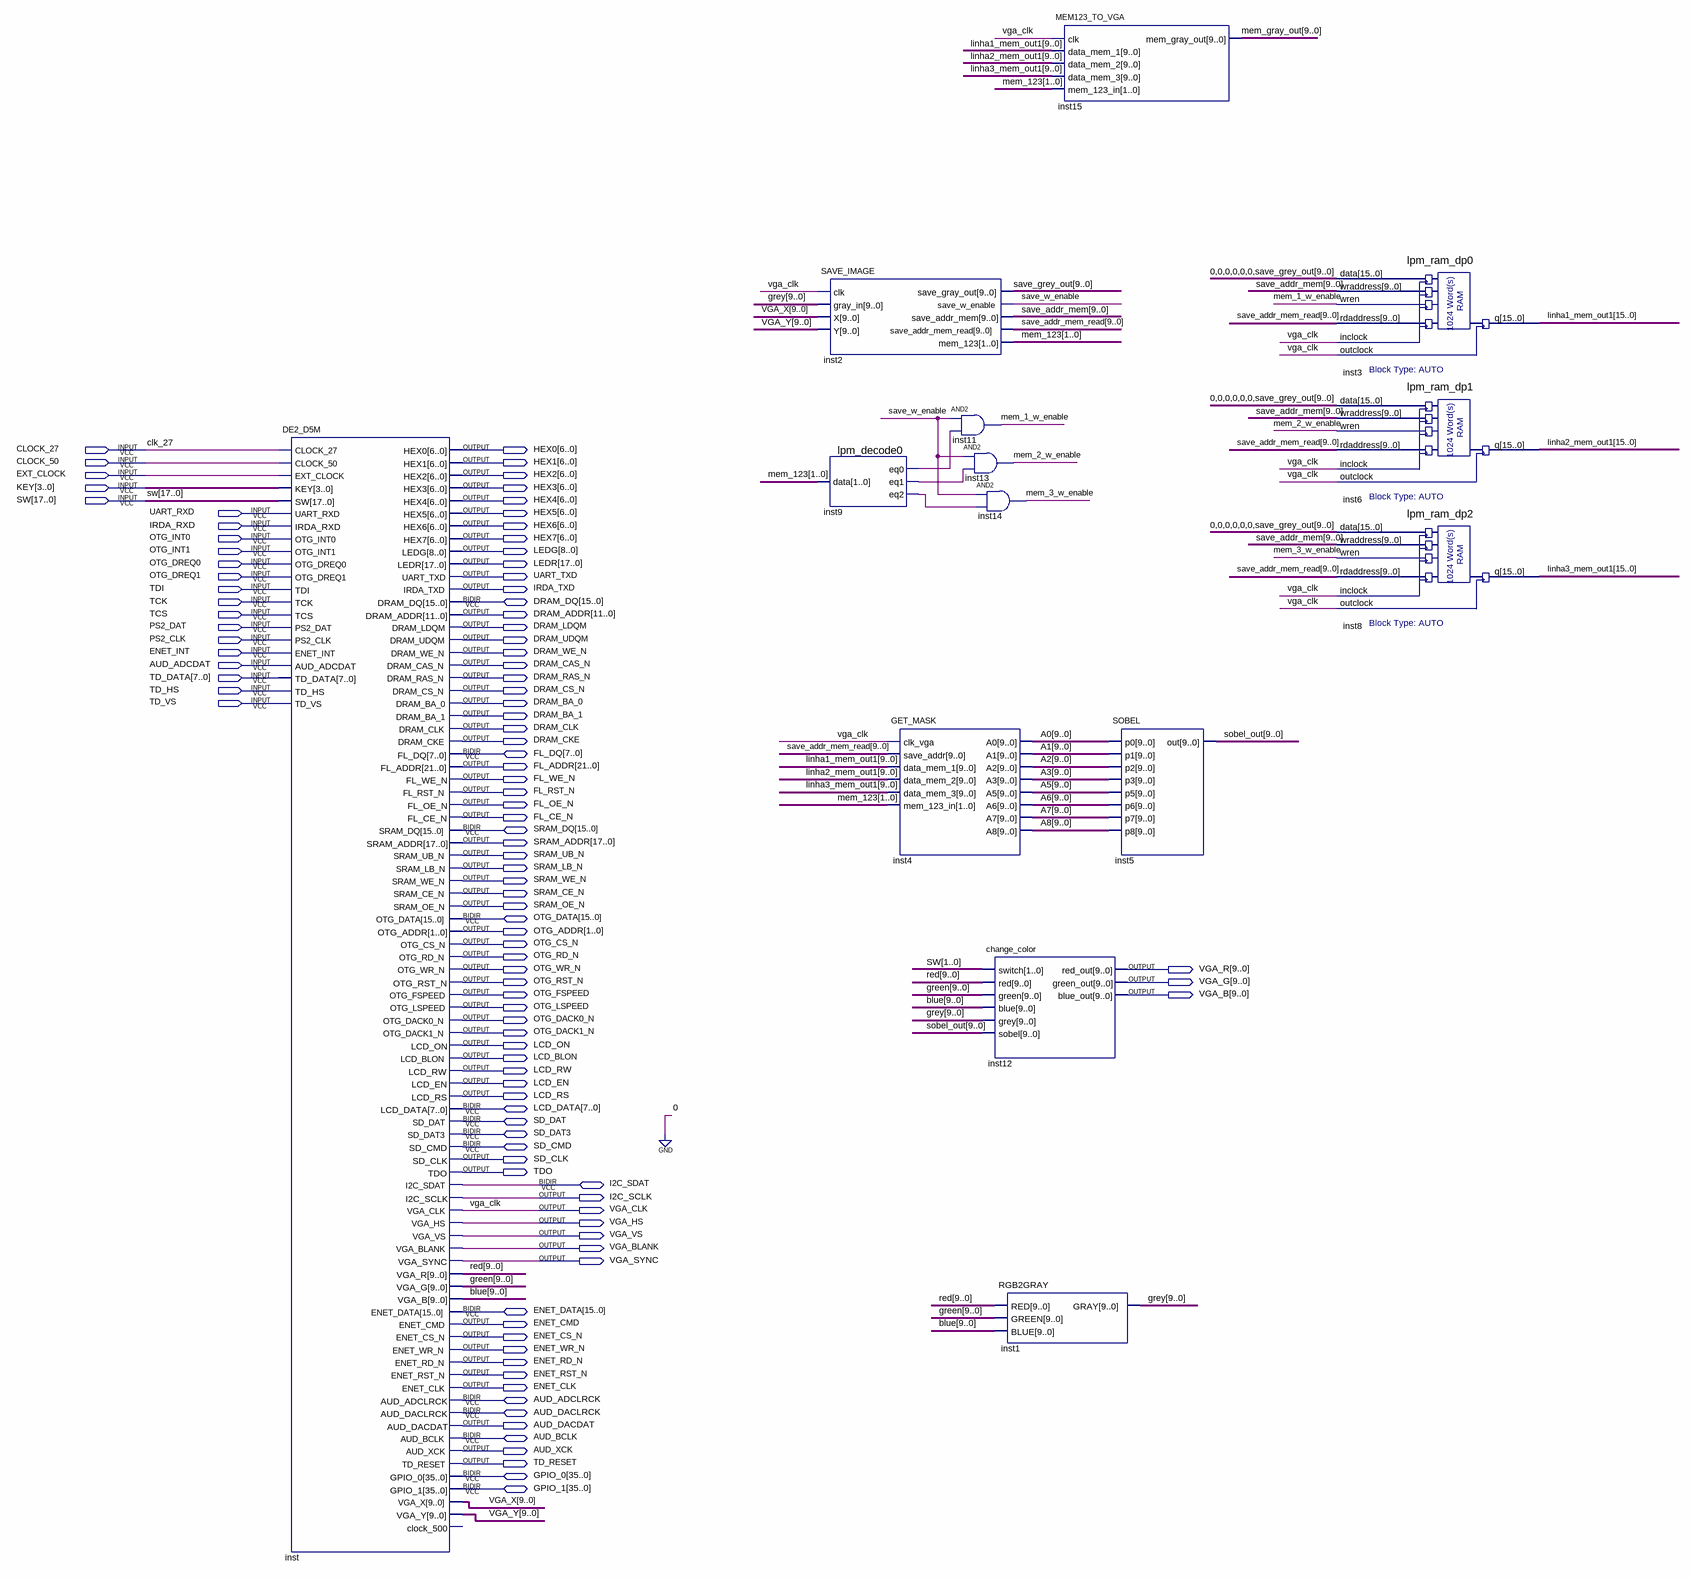
[diagram p0: schematic sheet]
// Quartus schematic MAIN.bdf as structural Verilog: 14 symbols, 104 pins
module MAIN (
  input  CLOCK_27,
  input  CLOCK_50,
  input  EXT_CLOCK,
  input  [3:0] KEY,
  input  [17:0] SW,
  input  UART_RXD,
  input  IRDA_RXD,
  input  OTG_INT0,
  input  OTG_INT1,
  input  OTG_DREQ0,
  input  OTG_DREQ1,
  input  TDI,
  input  TCK,
  input  TCS,
  input  PS2_DAT,
  input  PS2_CLK,
  input  ENET_INT,
  input  AUD_ADCDAT,
  input  [7:0] TD_DATA,
  input  TD_HS,
  input  TD_VS,
  inout  [15:0] DRAM_DQ,
  inout  [7:0] FL_DQ,
  inout  [15:0] SRAM_DQ,
  inout  [15:0] OTG_DATA,
  inout  [7:0] LCD_DATA,
  inout  SD_DAT,
  inout  SD_DAT3,
  inout  SD_CMD,
  inout  I2C_SDAT,
  inout  [15:0] ENET_DATA,
  inout  AUD_ADCLRCK,
  inout  AUD_DACLRCK,
  inout  AUD_BCLK,
  inout  [35:0] GPIO_0,
  inout  [35:0] GPIO_1,
  output [6:0] HEX0,
  output [6:0] HEX1,
  output [6:0] HEX2,
  output [6:0] HEX3,
  output [6:0] HEX4,
  output [6:0] HEX5,
  output [6:0] HEX6,
  output [6:0] HEX7,
  output [8:0] LEDG,
  output [17:0] LEDR,
  output UART_TXD,
  output IRDA_TXD,
  output [11:0] DRAM_ADDR,
  output DRAM_LDQM,
  output DRAM_UDQM,
  output DRAM_WE_N,
  output DRAM_CAS_N,
  output DRAM_RAS_N,
  output DRAM_CS_N,
  output DRAM_BA_0,
  output DRAM_BA_1,
  output DRAM_CLK,
  output DRAM_CKE,
  output [21:0] FL_ADDR,
  output FL_WE_N,
  output FL_RST_N,
  output FL_OE_N,
  output FL_CE_N,
  output [17:0] SRAM_ADDR,
  output SRAM_UB_N,
  output SRAM_LB_N,
  output SRAM_WE_N,
  output SRAM_CE_N,
  output SRAM_OE_N,
  output [1:0] OTG_ADDR,
  output OTG_CS_N,
  output OTG_RD_N,
  output OTG_WR_N,
  output [9:0] VGA_R,
  output OTG_RST_N,
  output [9:0] VGA_G,
  output OTG_FSPEED,
  output [9:0] VGA_B,
  output OTG_LSPEED,
  output OTG_DACK0_N,
  output OTG_DACK1_N,
  output LCD_ON,
  output LCD_BLON,
  output LCD_RW,
  output LCD_EN,
  output LCD_RS,
  output SD_CLK,
  output TDO,
  output I2C_SCLK,
  output VGA_CLK,
  output VGA_HS,
  output VGA_VS,
  output VGA_BLANK,
  output VGA_SYNC,
  output ENET_CMD,
  output ENET_CS_N,
  output ENET_WR_N,
  output ENET_RD_N,
  output ENET_RST_N,
  output ENET_CLK,
  output AUD_DACDAT,
  output AUD_XCK,
  output TD_RESET
);

  wire inst9_eq0, inst9_eq1, inst9_eq2, mem_1_w_enable, mem_2_w_enable, mem_3_w_enable, save_w_enable;
  wire [1:0] mem_123;
  wire [9:0] A0, A1, A2, A3, A5, A6, A7, A8, blue, green, grey, mem_gray_out, red, save_addr_mem,
       save_addr_mem_read, save_grey_out, sobel_out, VGA_X, VGA_Y;
  wire [15:0] linha1_mem_out1, linha2_mem_out1, linha3_mem_out1;

  DE2_D5M inst (
    .CLOCK_27(CLOCK_27), .CLOCK_50(CLOCK_50), .EXT_CLOCK(EXT_CLOCK), .KEY(KEY), .SW(SW), .UART_RXD(UART_RXD),
    .IRDA_RXD(IRDA_RXD), .OTG_INT0(OTG_INT0), .OTG_INT1(OTG_INT1), .OTG_DREQ0(OTG_DREQ0),
    .OTG_DREQ1(OTG_DREQ1), .TDI(TDI), .TCK(TCK), .TCS(TCS), .PS2_DAT(PS2_DAT), .PS2_CLK(PS2_CLK),
    .ENET_INT(ENET_INT), .AUD_ADCDAT(AUD_ADCDAT), .TD_DATA(TD_DATA), .TD_HS(TD_HS), .TD_VS(TD_VS),
    .HEX0(HEX0), .HEX1(HEX1), .HEX2(HEX2), .HEX3(HEX3), .HEX4(HEX4), .HEX5(HEX5), .HEX6(HEX6), .HEX7(HEX7),
    .LEDG(LEDG), .LEDR(LEDR), .UART_TXD(UART_TXD), .IRDA_TXD(IRDA_TXD), .DRAM_ADDR(DRAM_ADDR),
    .DRAM_LDQM(DRAM_LDQM), .DRAM_UDQM(DRAM_UDQM), .DRAM_WE_N(DRAM_WE_N), .DRAM_CAS_N(DRAM_CAS_N),
    .DRAM_RAS_N(DRAM_RAS_N), .DRAM_CS_N(DRAM_CS_N), .DRAM_BA_0(DRAM_BA_0), .DRAM_BA_1(DRAM_BA_1),
    .DRAM_CLK(DRAM_CLK), .DRAM_CKE(DRAM_CKE), .FL_ADDR(FL_ADDR), .FL_WE_N(FL_WE_N), .FL_RST_N(FL_RST_N),
    .FL_OE_N(FL_OE_N), .FL_CE_N(FL_CE_N), .SRAM_ADDR(SRAM_ADDR), .SRAM_UB_N(SRAM_UB_N),
    .SRAM_LB_N(SRAM_LB_N), .SRAM_WE_N(SRAM_WE_N), .SRAM_CE_N(SRAM_CE_N), .SRAM_OE_N(SRAM_OE_N),
    .OTG_ADDR(OTG_ADDR), .OTG_CS_N(OTG_CS_N), .OTG_RD_N(OTG_RD_N), .OTG_WR_N(OTG_WR_N),
    .OTG_RST_N(OTG_RST_N), .OTG_FSPEED(OTG_FSPEED), .OTG_LSPEED(OTG_LSPEED), .OTG_DACK0_N(OTG_DACK0_N),
    .OTG_DACK1_N(OTG_DACK1_N), .LCD_ON(LCD_ON), .LCD_BLON(LCD_BLON), .LCD_RW(LCD_RW), .LCD_EN(LCD_EN),
    .LCD_RS(LCD_RS), .SD_CLK(SD_CLK), .TDO(TDO), .I2C_SCLK(I2C_SCLK), .VGA_CLK(VGA_CLK), .VGA_HS(VGA_HS),
    .VGA_VS(VGA_VS), .VGA_BLANK(VGA_BLANK), .VGA_SYNC(VGA_SYNC), .VGA_R(red), .VGA_G(green), .VGA_B(blue),
    .ENET_CMD(ENET_CMD), .ENET_CS_N(ENET_CS_N), .ENET_WR_N(ENET_WR_N), .ENET_RD_N(ENET_RD_N),
    .ENET_RST_N(ENET_RST_N), .ENET_CLK(ENET_CLK), .AUD_DACDAT(AUD_DACDAT), .AUD_XCK(AUD_XCK),
    .TD_RESET(TD_RESET), .VGA_X(VGA_X), .VGA_Y(VGA_Y), .DRAM_DQ(DRAM_DQ), .FL_DQ(FL_DQ), .SRAM_DQ(SRAM_DQ),
    .OTG_DATA(OTG_DATA), .LCD_DATA(LCD_DATA), .SD_DAT(SD_DAT), .SD_DAT3(SD_DAT3), .SD_CMD(SD_CMD),
    .I2C_SDAT(I2C_SDAT), .ENET_DATA(ENET_DATA), .AUD_ADCLRCK(AUD_ADCLRCK), .AUD_DACLRCK(AUD_DACLRCK),
    .AUD_BCLK(AUD_BCLK), .GPIO_0(GPIO_0), .GPIO_1(GPIO_1));  // open: clock_500
  SAVE_IMAGE inst2 (
    .clk(VGA_CLK), .gray_in(grey), .X(VGA_X), .Y(VGA_Y), .save_gray_out(save_grey_out),
    .save_w_enable(save_w_enable), .save_addr_mem(save_addr_mem), .save_addr_mem_read(save_addr_mem_read),
    .mem_123(mem_123));
  lpm_decode0 inst9 (.data(mem_123), .eq0(inst9_eq0), .eq1(inst9_eq1), .eq2(inst9_eq2));
  GET_MASK inst4 (
    .clk_vga(VGA_CLK), .save_addr(save_addr_mem_read), .data_mem_1(linha1_mem_out1[9:0]),
    .data_mem_2(linha2_mem_out1[9:0]), .data_mem_3(linha3_mem_out1[9:0]), .mem_123_in(mem_123), .A0(A0),
    .A1(A1), .A2(A2), .A3(A3), .A5(A5), .A6(A6), .A7(A7), .A8(A8));
  and inst11 (mem_1_w_enable, save_w_enable, inst9_eq0);
  and inst13 (mem_2_w_enable, save_w_enable, inst9_eq1);
  and inst14 (mem_3_w_enable, save_w_enable, inst9_eq2);
  change_color inst12 (
    .switch(SW[1:0]), .red(red), .green(green), .blue(blue), .grey(grey), .sobel(sobel_out), .red_out(VGA_R),
    .green_out(VGA_G), .blue_out(VGA_B));
  RGB2GRAY inst1 (.RED(red), .GREEN(green), .BLUE(blue), .GRAY(grey));
  MEM123_TO_VGA inst15 (
    .clk(VGA_CLK), .data_mem_1(linha1_mem_out1[9:0]), .data_mem_2(linha2_mem_out1[9:0]),
    .data_mem_3(linha3_mem_out1[9:0]), .mem_123_in(mem_123), .mem_gray_out(mem_gray_out));
  SOBEL inst5 (.p0(A0), .p1(A1), .p2(A2), .p3(A3), .p5(A5), .p6(A6), .p7(A7), .p8(A8), .out(sobel_out));
  lpm_ram_dp0 inst3 (
    .data({{6{1'b0}}, save_grey_out}), .wraddress(save_addr_mem), .wren(mem_1_w_enable),
    .rdaddress(save_addr_mem_read), .inclock(VGA_CLK), .outclock(VGA_CLK), .q(linha1_mem_out1));
  lpm_ram_dp1 inst6 (
    .data({{6{1'b0}}, save_grey_out}), .wraddress(save_addr_mem), .wren(mem_2_w_enable),
    .rdaddress(save_addr_mem_read), .inclock(VGA_CLK), .outclock(VGA_CLK), .q(linha2_mem_out1));
  lpm_ram_dp2 inst8 (
    .data({{6{1'b0}}, save_grey_out}), .wraddress(save_addr_mem), .wren(mem_3_w_enable),
    .rdaddress(save_addr_mem_read), .inclock(VGA_CLK), .outclock(VGA_CLK), .q(linha3_mem_out1));

  // Other names for the same wires on the sheet: clk_27 = CLOCK_27
endmodule
